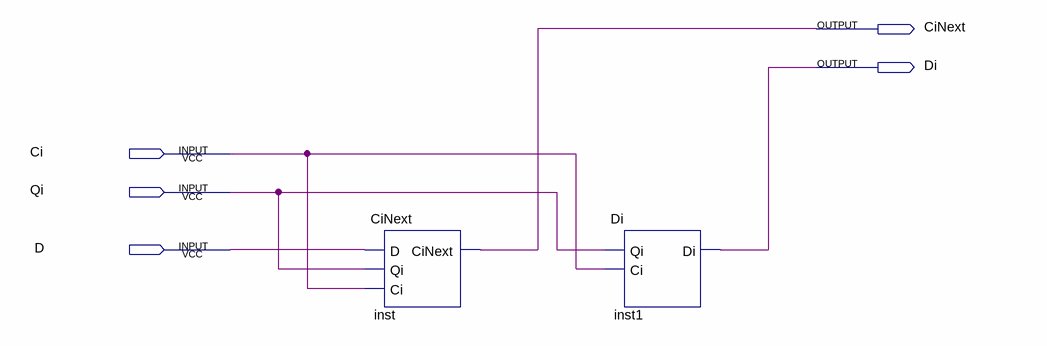
[diagram p0: schematic sheet]
// Quartus schematic HAS.bdf as structural Verilog: 2 symbols, 5 pins
module HAS (
  input  Ci,
  input  Qi,
  input  D,
  output CiNext,
  output Di
);

  CiNext inst (.D(D), .Qi(Qi), .Ci(Ci), .CiNext(CiNext));
  Di inst1 (.Qi(Qi), .Ci(Ci), .Di(Di));
endmodule
